# Altium schematic sheet MDQARM_COIL.SchDoc
size A3; Organization: Altium Limited; Address1: L3, 12a Rodborough Rd; Address2: Frenchs Forest; Address3: NSW; Address4: Australia 2086
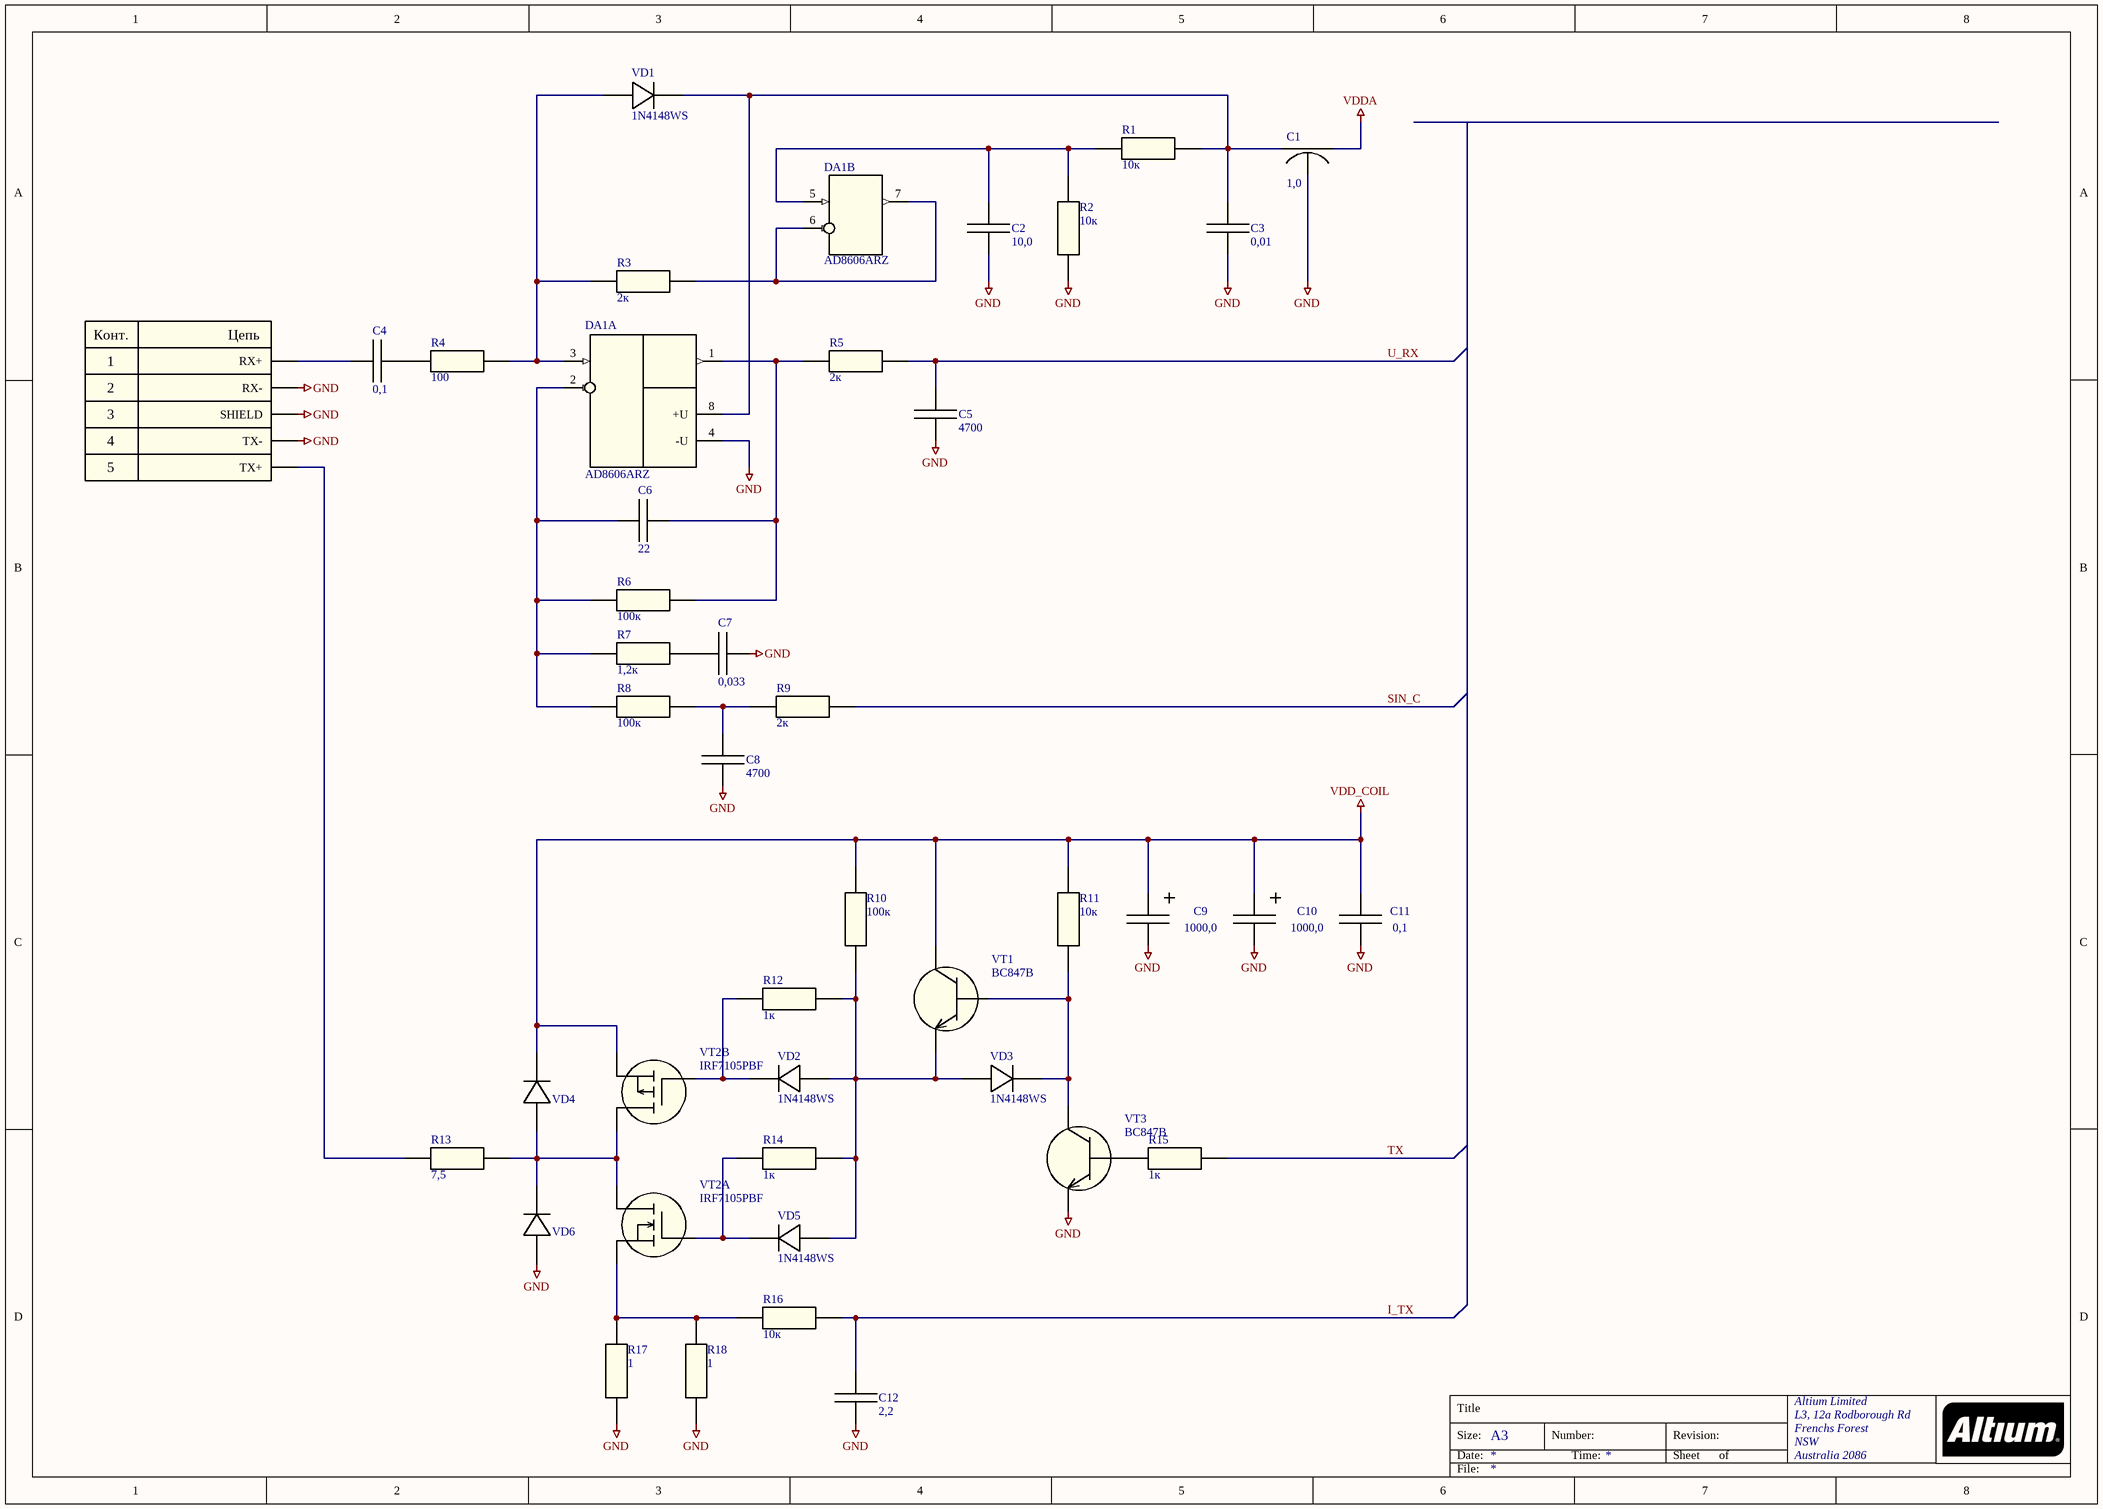
[diagram p0: MDQARM_COIL.SchDoc]

## Parts
*1  Connector MD_COIL  [Connector MD_COIL]  (value not drawn)
C1  1,0  [Filter NFM21PC]
C2  10,0  [Capacitor SMD0805-T1.35]
C3  0,01  [Capacitor SMD0805-T0.75]
C4  0,1  [Capacitor SMD0805_5mm]
C5  4700  [Capacitor SMD0805-T0.75]
C6  22  [Capacitor SMD0805-T0.75]
C7  0,033  [Capacitor SMD0805_5mm]
C8  4700  [Capacitor SMD0805-T0.75]
C9  1000,0  [Capacitor ECAP SMD10x10.5]
C10  1000,0  [Capacitor ECAP SMD10x10.5]
C11  0,1  [Capacitor SMD0805-T0.95]
C12  2,2  [Capacitor SMD0805-T1.35]
DA1  AD8606ARZ  [IC AD8606ARZ]  (parts A,B of 2)
R1  10к  [Resistor SMD0805]
R2  10к  [Resistor SMD0805]
R3  2к  [Resistor SMD0805]
R4  100  [Resistor SMD0805]
R5  2к  [Resistor SMD0805]
R6  100к  [Resistor SMD0805]
R7  1,2к  [Resistor SMD0805]
R8  100к  [Resistor SMD0805]
R9  2к  [Resistor SMD0805]
R10  100к  [Resistor SMD0805]
R11  10к  [Resistor SMD0805]
R12  1к  [Resistor SMD0805]
R13  7,5  [Resistor SMD2512]
R14  1к  [Resistor SMD0805]
R15  1к  [Resistor SMD0805]
R16  10к  [Resistor SMD0805]
R17  1  [Resistor SMD1206]
R18  1  [Resistor SMD1206]
VD1  1N4148WS  [Diode SOD-323]
VD2  1N4148WS  [Diode SOD-323]
VD3  1N4148WS  [Diode SOD-323]
VD4  ES1J  [Diode SMA]  (value not drawn)
VD5  1N4148WS  [Diode SOD-323]
VD6  ES1J  [Diode SMA]  (value not drawn)
VT1  BC847B  [Transistor SOT23]
VT2  IRF7105PBF  [Transisror IRF7105]  (parts A,B of 2)
VT3  BC847B  [Transistor SOT23]

## Nets
GND: *1.2(RX-) *1.3(SHIELD) *1.4(TX-) C1.2 C2.1 C3.1 C5.1 C7.1 C8.1 C9.2 C10.2 C11.2 C12.1 DA1.4(-U) R2.1 R17.1 R18.1 VD6.1(A) VT3.2(E)
VDD_COIL: C9.1 C10.1 C11.1 R10.2 R11.2 VD4.2(C) VT1.3(C) VT2.S2
VDDA: C1.3
I_TX: C12.2 R16.2
SIN_C: R9.1
TX: R15.2
U_RX: C5.2 R5.2
Net*1_1: *1.1(RX+) C4.2
Net*1_5: *1.5(TX+) R13.1
NetC1_1: C1.1 C3.2 DA1.8(+U) R1.2 VD1.2(C)
NetC2_2: C2.2 DA1.5(INB+) R1.1 R2.2
NetC4_1: C4.1 R4.1
NetC6_1: C6.1 DA1.2(-INA) R6.1 R7.1 R8.2
NetC6_2: C6.2 DA1.1(OUTA) R5.1 R6.2
NetC7_2: C7.2 R7.2
NetC8_2: C8.2 R8.1 R9.2
NetDA1_3: DA1.3(+INA) R3.1 R4.2 VD1.1(A)
NetDA1_6: DA1.6(INB-) DA1.7(OUTB) R3.2
NetR10_1: R10.1 R12.2 R14.2 VD2.1(A) VD3.1(A) VD5.1(A) VT1.2(E)
NetR11_1: R11.1 VD3.2(C) VT1.1(B) VT3.3(C)
NetR12_1: R12.1 VD2.2(C) VT2.G2
NetR13_2: R13.2 VD4.1(A) VD6.2(C) VT2.D1 VT2.D2
NetR14_1: R14.1 VD5.2(C) VT2.G1
NetR15_1: R15.1 VT3.1(B)
NetR16_1: R16.1 R17.2 R18.2 VT2.S1

## Notes on the sheet
- Title
- Size:
- Date:
- A3
- Number:
- Time:
- Revision:
- Sheet
- of
- File:
- (in symbol Connector MD_COIL) Конт.; Цепь

## Library data of the parts
C1 = Filter NFM21PC105B1С3D: Value: 1,0
C2 = Capacitor C0805_10u: Value: 10,0
C3 = Capacitor C0805_10n: Value: 0,01
C4 = Capacitor C0805_5mm_100n: Value: 0,1
C5 C8 = Capacitor C0805_4.7n: Value: 4700
C6 = Capacitor C0805_22p: Value: 22
C7 = Capacitor C0805_5mm_33n: Value: 0,033
C9 C10 = Capacitor ECAP SMD 1000uF_6.3V: Value: 1000,0
C11 = Capacitor C0805_100n: Value: 0,1
C12 = Capacitor C0805_2.2u: Value: 2,2
DA1 = IC AD8606ARZ: Value: AD8606ARZ
R1 R2 = Resistor R0805_10k_1%: Value: 10к
R3 = Resistor R0805_2k_1%: Value: 2к
R4 = Resistor R0805_100_1%: Value: 100
R5 R9 = Resistor R0805_2k_5%: Value: 2к
R6 R8 = Resistor R0805_100k_1%: Value: 100к
R7 = Resistor R0805_1.2k_1%: Value: 1,2к
R10 = Resistor R0805_100k_5%: Value: 100к
R11 R16 = Resistor R0805_10k_5%: Value: 10к
R12 R14 R15 = Resistor R0805_1k_5%: Value: 1к
R13 = Resistor R2512_7.5R_5%: Value: 7,5
R17 R18 = Resistor R1206_1R_5%: Value: 1
VD1-VD3 VD5 = Diode 1N4148WS: 150mA 100V 4ns
VD4 VD6 = Diode ES1J: 1A 600V 35ns
VT1 VT3 = Transistor BC847B: Value: BC847B
VT2 = Transistor IRF7105PBF: Value: IRF7105BPF